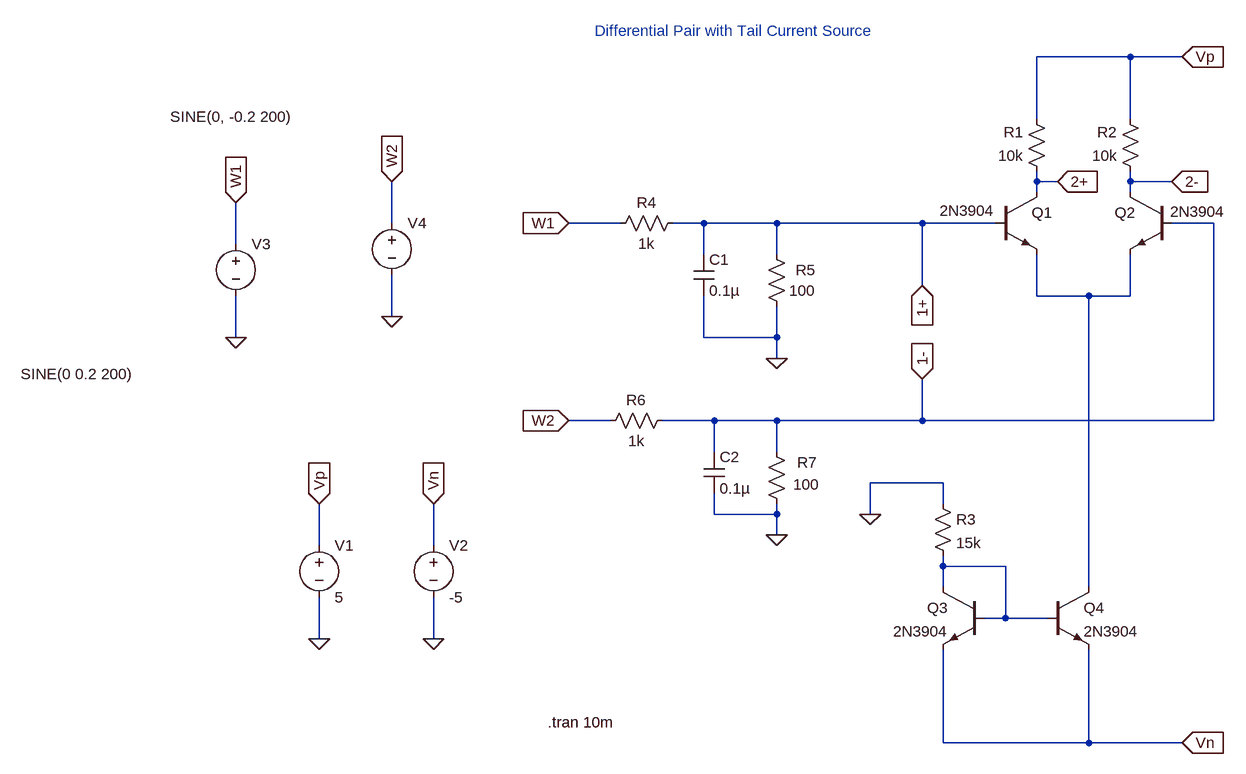
[diagram p0: schematic diff_pair_tail_mirror.asc]
diff_pair_tail_mirror.asc, the LTspice schematic file:
Version 4
SHEET 1 1032 872
WIRE 864 -256 720 -256
WIRE 944 -256 864 -256
WIRE 720 -160 720 -256
WIRE 864 -160 864 -256
WIRE 720 -64 720 -80
WIRE 752 -64 720 -64
WIRE 864 -64 864 -80
WIRE 928 -64 864 -64
WIRE 720 -48 720 -64
WIRE 864 -48 864 -64
WIRE -272 0 -272 -64
WIRE 80 0 0 0
WIRE 208 0 160 0
WIRE 320 0 208 0
WIRE 544 0 320 0
WIRE 656 0 544 0
WIRE 992 0 928 0
WIRE -512 32 -512 -32
WIRE 208 48 208 0
WIRE 320 48 320 0
WIRE 544 96 544 0
WIRE 720 112 720 48
WIRE 800 112 720 112
WIRE 864 112 864 48
WIRE 864 112 800 112
WIRE -272 144 -272 80
WIRE -512 176 -512 112
WIRE 208 176 208 112
WIRE 320 176 320 128
WIRE 320 176 208 176
WIRE 320 208 320 176
WIRE 64 304 0 304
WIRE 224 304 144 304
WIRE 320 304 224 304
WIRE 544 304 544 240
WIRE 544 304 320 304
WIRE 992 304 992 0
WIRE 992 304 544 304
WIRE 224 352 224 304
WIRE 320 352 320 304
WIRE 576 400 464 400
WIRE 576 432 576 400
WIRE 224 448 224 416
WIRE 320 448 320 432
WIRE 320 448 224 448
WIRE 464 448 464 400
WIRE 320 480 320 448
WIRE -384 496 -384 432
WIRE -208 496 -208 432
WIRE 576 528 576 512
WIRE 672 528 576 528
WIRE 576 560 576 528
WIRE 800 560 800 112
WIRE 672 608 672 528
WIRE 672 608 640 608
WIRE 736 608 672 608
WIRE -384 640 -384 576
WIRE -208 640 -208 576
WIRE 576 800 576 656
WIRE 800 800 800 656
WIRE 800 800 576 800
WIRE 944 800 800 800
FLAG 320 208 0
FLAG 320 480 0
FLAG 944 -256 Vp
IOPIN 944 -256 In
FLAG 0 0 W1
IOPIN 0 0 In
FLAG 0 304 W2
IOPIN 0 304 In
FLAG -384 640 0
FLAG -208 640 0
FLAG -512 176 0
FLAG -272 144 0
FLAG -384 432 Vp
IOPIN -384 432 In
FLAG -208 432 Vn
IOPIN -208 432 In
FLAG -512 -32 W1
IOPIN -512 -32 In
FLAG -272 -64 W2
IOPIN -272 -64 In
FLAG 928 -64 2-
IOPIN 928 -64 In
FLAG 944 800 Vn
IOPIN 944 800 In
FLAG 464 448 0
FLAG 544 96 1+
IOPIN 544 96 In
FLAG 544 240 1-
IOPIN 544 240 In
FLAG 752 -64 2+
IOPIN 752 -64 In
SYMBOL res 736 -64 R180
WINDOW 0 36 76 Left 2
WINDOW 3 36 40 Left 2
SYMATTR InstName R1
SYMATTR Value 10k
SYMBOL res 880 -64 R180
WINDOW 0 36 76 Left 2
WINDOW 3 36 40 Left 2
SYMATTR InstName R2
SYMATTR Value 10k
SYMBOL res 64 16 R270
WINDOW 0 32 56 VTop 2
WINDOW 3 0 56 VBottom 2
SYMATTR InstName R4
SYMATTR Value 1k
SYMBOL res 336 144 R180
WINDOW 0 -44 72 Left 2
WINDOW 3 -44 40 Left 2
SYMATTR InstName R5
SYMATTR Value 100
SYMBOL res 48 320 R270
WINDOW 0 32 56 VTop 2
WINDOW 3 0 56 VBottom 2
SYMATTR InstName R6
SYMATTR Value 1k
SYMBOL res 336 448 R180
WINDOW 0 -46 80 Left 2
WINDOW 3 -50 46 Left 2
SYMATTR InstName R7
SYMATTR Value 100
SYMBOL npn 656 -48 R0
WINDOW 3 -85 29 Left 2
SYMATTR Value 2N3904
SYMATTR InstName Q1
SYMBOL npn 928 -48 M0
WINDOW 3 -82 30 Left 2
SYMATTR Value 2N3904
SYMATTR InstName Q2
SYMBOL cap 192 48 R0
SYMATTR InstName C1
SYMATTR Value 0.1µ
SYMBOL cap 208 352 R0
SYMATTR InstName C2
SYMATTR Value 0.1µ
SYMBOL voltage -384 480 R0
WINDOW 123 0 0 Left 0
WINDOW 39 0 0 Left 0
SYMATTR InstName V1
SYMATTR Value 5
SYMBOL voltage -208 480 R0
WINDOW 123 0 0 Left 0
WINDOW 39 0 0 Left 0
SYMATTR InstName V2
SYMATTR Value -5
SYMBOL voltage -512 16 R0
WINDOW 3 -331 216 Left 2
WINDOW 123 0 0 Left 0
WINDOW 39 0 0 Left 0
SYMATTR Value SINE(0 0.2 200)
SYMATTR InstName V3
SYMBOL voltage -272 -16 R0
WINDOW 3 -341 -148 Left 2
WINDOW 123 0 0 Left 0
WINDOW 39 0 0 Left 0
SYMATTR Value SINE(0, -0.2 200)
SYMATTR InstName V4
SYMBOL npn 736 560 R0
SYMATTR InstName Q4
SYMATTR Value 2N3904
SYMBOL res 560 416 R0
SYMATTR InstName R3
SYMATTR Value 15k
SYMBOL npn 640 560 M0
SYMATTR InstName Q3
SYMATTR Value 2N3904
TEXT -32 768 Left 2 !.tran 10m
TEXT 40 -296 Left 2 ;Differential Pair with Tail Current Source

The netlist it stands for:
* diff_pair_tail_mirror.asc
R1 2+ Vp 10k
R2 2- Vp 10k
R4 W1 1+ 1k
R5 0 1+ 100
R6 W2 1- 1k
R7 0 1- 100
Q1 2+ 1+ N001 0 2N3904
Q2 2- 1- N001 0 2N3904
C1 1+ 0 0.1µ
C2 1- 0 0.1µ
V1 Vp 0 5
V2 Vn 0 -5
V3 W1 0 SINE(0 0.2 200)
V4 W2 0 SINE(0, -0.2 200)
Q4 N001 N002 Vn 0 2N3904
R3 0 N002 15k
Q3 N002 N002 Vn 0 2N3904
.model NPN NPN
.model PNP PNP
.lib standard.bjt
.tran 10m
* Differential Pair with Tail Current Source
.backanno
.end